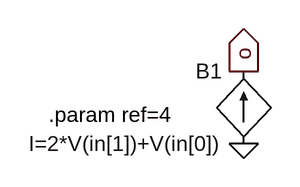
[diagram p0: schematic dac-2bit-fast.asc]
dac-2bit-fast.asc, the LTspice schematic file:
Version 4
SHEET 1 880 680
FLAG 224 -48 o
IOPIN 224 -48 Out
FLAG 224 32 0
SYMBOL bi 224 32 R180
WINDOW 0 24 80 Left 2
WINDOW 3 24 0 Left 2
SYMATTR InstName B1
SYMATTR Value I=2*V(in[1])+V(in[0])
SYMATTR Value2 Rpar={ref/4}
TEXT 8 0 Left 2 !.param ref=4

The netlist it stands for:
* dac-2bit-fast.asc
B1 0 o I=2*V(in[1])+V(in[0]) Rpar={ref/4}
.param ref=4
.backanno
.end